# EAGLE design SOIC8 to DIP (EAGLE 6.4)
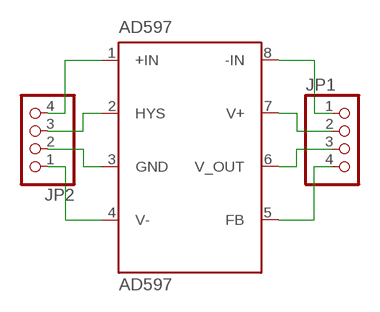
[diagram p0: schematic, sheet 1]

## Parts
AD597  AD597  [SO8]
JP1  PINHD-1X4  [1X04]
JP2  PINHD-1X4  [1X04]

## Nets
N$1: AD597.1(+IN) JP2.4
N$3: AD597.2(HYS) JP2.3
N$4: AD597.3(GND) JP2.2
N$5: AD597.4(V-) JP2.1
N$7: AD597.6(V_OUT) JP1.3
N$11: AD597.7(V+) JP1.2
N$12: AD597.8(-IN) JP1.1
N$13: AD597.5(FB) JP1.4

## Library data of the parts
AD597 = analog-devices:AD597
JP1 JP2 = pinhead:PINHD-1X4: PIN HEADER

## Board
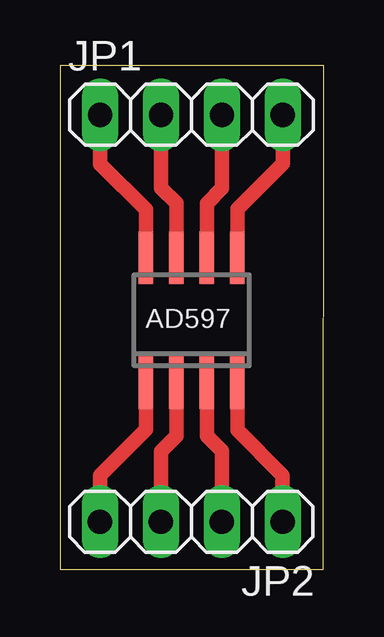
[diagram p1: board, top side]

Size 11.01 x 21 mm. Coordinates in mm from the lower left corner, seen from the top.
Outline: 0,0 11,0 11.01,21 0,21 0,0
Copper layers (1*16): Top 0.035mm / dielectric 1.5mm / Bottom 0.035mm
Design rules "default": minimum track width 10mil, minimum drill 24mil, track to track 8mil, track to pad 8mil, pad to pad 8mil, via to via 8mil, smd to smd 8mil, copper to edge 40mil, drill to drill 8mil, minimum pad ring 10mil, minimum via ring 8mil, stop-mask expansion 4mil, vias tented up to drill 0mil, thermal gap 10mil

### Footprints (pad centres in the part's own frame; a part is rotated, then mirrored left to right if it is on the bottom)
SO8 = smd 0.6 x 2.2: 1 -1.905,-2.6; 2 -0.635,-2.6; 3 0.635,-2.6; 4 1.905,-2.6; 5 1.905,2.6; 6 0.635,2.6; 7 -0.635,2.6; 8 -1.905,2.6
1X04 = drill 1.016 long: 1 -3.81,0; 2 -1.27,0; 3 1.27,0; 4 3.81,0

### Placement (x,y rotation side)
AD597  5.49,10.4 0 top
JP1  5.49,18.96 0 top
JP2  5.48,1.99 180 top

### Tracks (layer width: path | path; a pad name or v marks a point on that pad's centre or on a via)
N$1
  Top 0.61: AD597.1 3.59,5.85 1.67,3.93 JP2.4
N$3
  Top 0.61: AD597.2 4.86,5.57 4.21,4.92 JP2.3
N$4
  Top 0.61: AD597.3 6.13,5.56 6.75,4.94 JP2.2
N$5
  Top 0.61: AD597.4 7.4,5.81 9.29,3.92 JP2.1
N$7
  Top 0.61: AD597.6 6.13,15.26 6.77,15.9 6.77,18.95 JP1.3
N$11
  Top 0.61: AD597.7 4.86,15.27 4.22,15.91 JP1.2
N$12
  Top 0.61: AD597.8 3.59,15 1.68,16.91 JP1.1
N$13
  Top 0.61: AD597.5 7.4,15.03 9.3,16.93 JP1.4